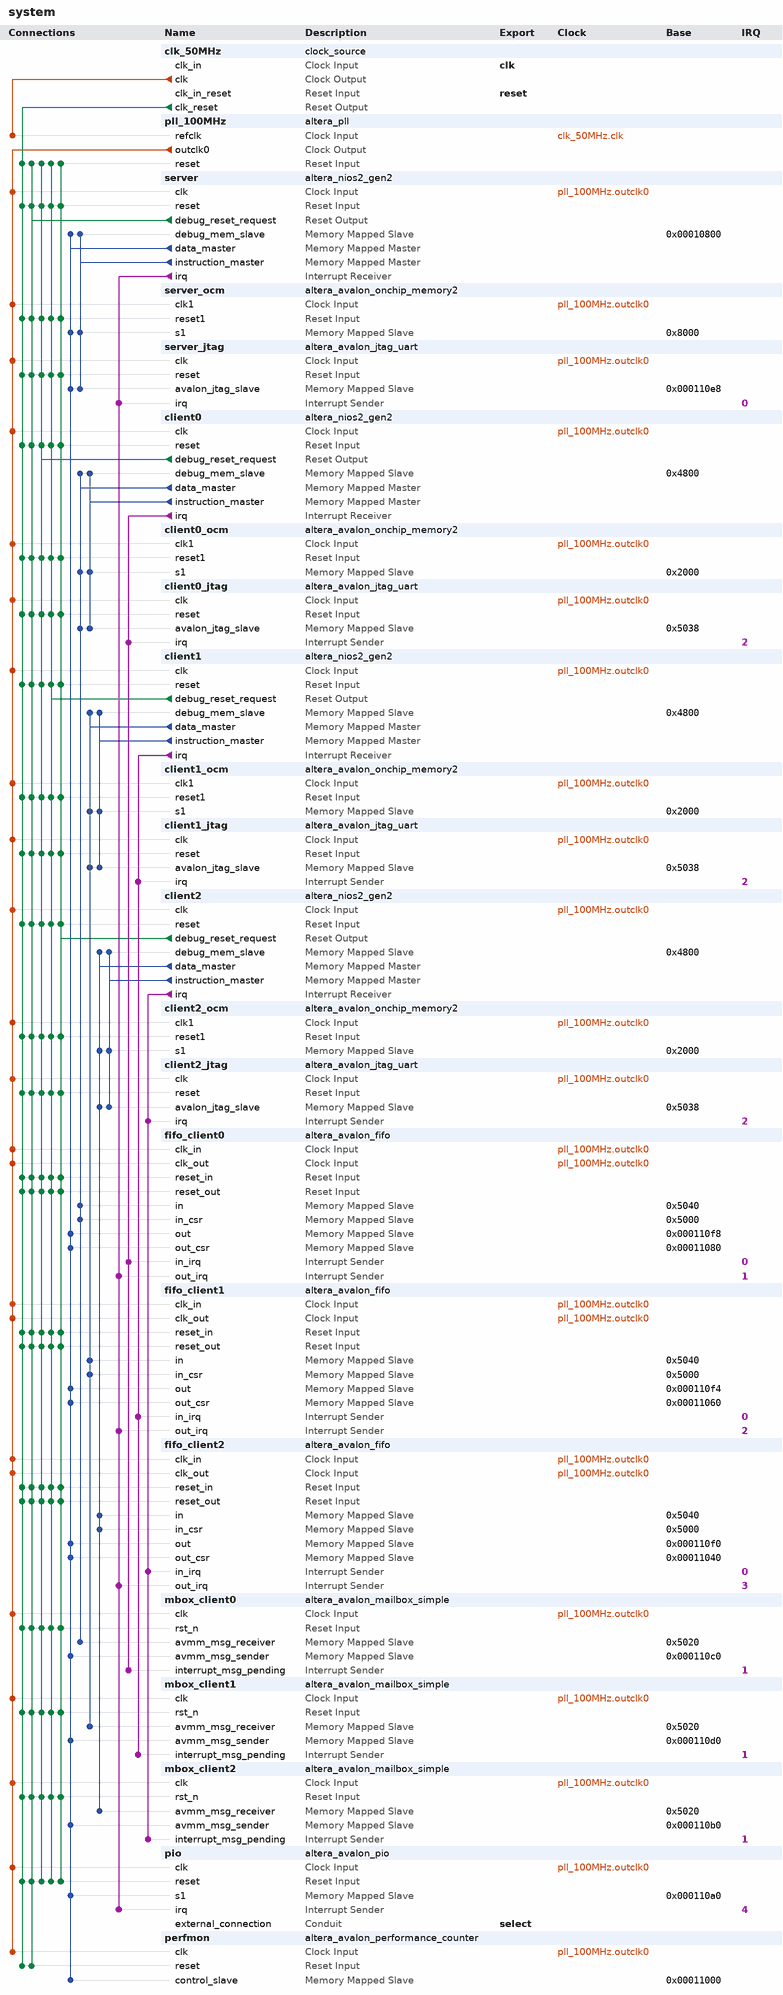
[diagram p0: system contents]
# Platform Designer (Qsys) system system, Cyclone V 5CSEMA5F31C6
# Parameters at their usual value, and those the tool derives, are not listed.
package require -exact qsys 17.0
create_system system
set_project_property DEVICE_FAMILY {Cyclone V}
set_project_property DEVICE 5CSEMA5F31C6

add_instance clk_50MHz clock_source 17.0
set_instance_parameter_value clk_50MHz clockFrequency 50000000

add_instance pll_100MHz altera_pll 17.0
set_instance_parameter_value pll_100MHz gui_device_speed_grade 1
set_instance_parameter_value pll_100MHz gui_number_of_clocks 1
set_instance_parameter_value pll_100MHz gui_operation_mode direct
set_instance_parameter_value pll_100MHz gui_output_clock_frequency0 100.0
set_instance_parameter_value pll_100MHz gui_pll_mode {Integer-N PLL}
set_instance_parameter_value pll_100MHz gui_reference_clock_frequency 50.0
set_instance_parameter_value pll_100MHz gui_use_locked false

add_instance server altera_nios2_gen2 17.0
set_instance_parameter_value server cpuID 1
set_instance_parameter_value server dcache_size 2048
set_instance_parameter_value server exceptionSlave server_ocm.s1
set_instance_parameter_value server icache_size 4096
set_instance_parameter_value server impl Fast
set_instance_parameter_value server resetSlave server_ocm.s1

add_instance server_ocm altera_avalon_onchip_memory2 17.0
set_instance_parameter_value server_ocm dataWidth 32
set_instance_parameter_value server_ocm dualPort false
set_instance_parameter_value server_ocm initMemContent false
set_instance_parameter_value server_ocm initializationFileName onchip_mem.hex
set_instance_parameter_value server_ocm memorySize 32768

add_instance server_jtag altera_avalon_jtag_uart 17.0
set_instance_parameter_value server_jtag simInteractiveOptions NO_INTERACTIVE_WINDOWS

add_instance client0 altera_nios2_gen2 17.0
set_instance_parameter_value client0 cpuID 16
set_instance_parameter_value client0 dcache_size 2048
set_instance_parameter_value client0 exceptionSlave client0_ocm.s1
set_instance_parameter_value client0 icache_size 4096
set_instance_parameter_value client0 impl Fast
set_instance_parameter_value client0 resetSlave client0_ocm.s1

add_instance client0_ocm altera_avalon_onchip_memory2 17.0
set_instance_parameter_value client0_ocm dataWidth 32
set_instance_parameter_value client0_ocm dualPort false
set_instance_parameter_value client0_ocm initMemContent false
set_instance_parameter_value client0_ocm initializationFileName onchip_mem.hex
set_instance_parameter_value client0_ocm memorySize 8192

add_instance client0_jtag altera_avalon_jtag_uart 17.0
set_instance_parameter_value client0_jtag simInteractiveOptions NO_INTERACTIVE_WINDOWS

add_instance client1 altera_nios2_gen2 17.0
set_instance_parameter_value client1 cpuID 17
set_instance_parameter_value client1 dcache_size 2048
set_instance_parameter_value client1 exceptionSlave client1_ocm.s1
set_instance_parameter_value client1 icache_size 4096
set_instance_parameter_value client1 impl Fast
set_instance_parameter_value client1 resetSlave client1_ocm.s1

add_instance client1_ocm altera_avalon_onchip_memory2 17.0
set_instance_parameter_value client1_ocm dataWidth 32
set_instance_parameter_value client1_ocm dualPort false
set_instance_parameter_value client1_ocm initMemContent false
set_instance_parameter_value client1_ocm initializationFileName onchip_mem.hex
set_instance_parameter_value client1_ocm memorySize 8192

add_instance client1_jtag altera_avalon_jtag_uart 17.0
set_instance_parameter_value client1_jtag simInteractiveOptions NO_INTERACTIVE_WINDOWS

add_instance client2 altera_nios2_gen2 17.0
set_instance_parameter_value client2 cpuID 18
set_instance_parameter_value client2 dcache_size 2048
set_instance_parameter_value client2 exceptionSlave client2_ocm.s1
set_instance_parameter_value client2 icache_size 4096
set_instance_parameter_value client2 impl Fast
set_instance_parameter_value client2 resetSlave client2_ocm.s1

add_instance client2_ocm altera_avalon_onchip_memory2 17.0
set_instance_parameter_value client2_ocm dataWidth 32
set_instance_parameter_value client2_ocm dualPort false
set_instance_parameter_value client2_ocm initMemContent false
set_instance_parameter_value client2_ocm initializationFileName onchip_mem.hex
set_instance_parameter_value client2_ocm memorySize 8192

add_instance client2_jtag altera_avalon_jtag_uart 17.0
set_instance_parameter_value client2_jtag simInteractiveOptions NO_INTERACTIVE_WINDOWS

add_instance fifo_client0 altera_avalon_fifo 17.0
set_instance_parameter_value fifo_client0 bitsPerSymbol 16
set_instance_parameter_value fifo_client0 channelWidth 8
set_instance_parameter_value fifo_client0 errorWidth 8
set_instance_parameter_value fifo_client0 fifoDepth 16
set_instance_parameter_value fifo_client0 fifoInputInterfaceOptions AVALONMM_WRITE
set_instance_parameter_value fifo_client0 fifoOutputInterfaceOptions AVALONMM_READ
set_instance_parameter_value fifo_client0 singleClockMode false
set_instance_parameter_value fifo_client0 symbolsPerBeat 2
set_instance_parameter_value fifo_client0 useIRQ true
set_instance_parameter_value fifo_client0 usePacket true
set_instance_parameter_value fifo_client0 useReadControl true

add_instance fifo_client1 altera_avalon_fifo 17.0
set_instance_parameter_value fifo_client1 bitsPerSymbol 16
set_instance_parameter_value fifo_client1 channelWidth 8
set_instance_parameter_value fifo_client1 errorWidth 8
set_instance_parameter_value fifo_client1 fifoDepth 16
set_instance_parameter_value fifo_client1 fifoInputInterfaceOptions AVALONMM_WRITE
set_instance_parameter_value fifo_client1 fifoOutputInterfaceOptions AVALONMM_READ
set_instance_parameter_value fifo_client1 singleClockMode false
set_instance_parameter_value fifo_client1 symbolsPerBeat 2
set_instance_parameter_value fifo_client1 useIRQ true
set_instance_parameter_value fifo_client1 usePacket true
set_instance_parameter_value fifo_client1 useReadControl true

add_instance fifo_client2 altera_avalon_fifo 17.0
set_instance_parameter_value fifo_client2 bitsPerSymbol 16
set_instance_parameter_value fifo_client2 channelWidth 8
set_instance_parameter_value fifo_client2 errorWidth 8
set_instance_parameter_value fifo_client2 fifoDepth 16
set_instance_parameter_value fifo_client2 fifoInputInterfaceOptions AVALONMM_WRITE
set_instance_parameter_value fifo_client2 fifoOutputInterfaceOptions AVALONMM_READ
set_instance_parameter_value fifo_client2 singleClockMode false
set_instance_parameter_value fifo_client2 symbolsPerBeat 2
set_instance_parameter_value fifo_client2 useIRQ true
set_instance_parameter_value fifo_client2 usePacket true
set_instance_parameter_value fifo_client2 useReadControl true

add_instance mbox_client0 altera_avalon_mailbox_simple 17.0
set_instance_parameter_value mbox_client0 AWIDTH 2
set_instance_parameter_value mbox_client0 DWIDTH 32
set_instance_parameter_value mbox_client0 MSG_ARRIVAL_NOTIFY 1
set_instance_parameter_value mbox_client0 MSG_SPACE_NOTIFY 0

add_instance mbox_client1 altera_avalon_mailbox_simple 17.0
set_instance_parameter_value mbox_client1 AWIDTH 2
set_instance_parameter_value mbox_client1 DWIDTH 32
set_instance_parameter_value mbox_client1 MSG_ARRIVAL_NOTIFY 1
set_instance_parameter_value mbox_client1 MSG_SPACE_NOTIFY 0

add_instance mbox_client2 altera_avalon_mailbox_simple 17.0
set_instance_parameter_value mbox_client2 AWIDTH 2
set_instance_parameter_value mbox_client2 DWIDTH 32
set_instance_parameter_value mbox_client2 MSG_ARRIVAL_NOTIFY 1
set_instance_parameter_value mbox_client2 MSG_SPACE_NOTIFY 0

add_instance pio altera_avalon_pio 17.0
set_instance_parameter_value pio bitClearingEdgeCapReg true
set_instance_parameter_value pio captureEdge true
set_instance_parameter_value pio direction Input
set_instance_parameter_value pio edgeType ANY
set_instance_parameter_value pio generateIRQ true
set_instance_parameter_value pio irqType EDGE
set_instance_parameter_value pio width 1

add_instance perfmon altera_avalon_performance_counter 17.0
set_instance_parameter_value perfmon numberOfSections 3

# connections
add_connection clk_50MHz.clk pll_100MHz.refclk clock
add_connection pll_100MHz.outclk0 client0.clk clock
add_connection pll_100MHz.outclk0 client0_jtag.clk clock
add_connection pll_100MHz.outclk0 client0_ocm.clk1 clock
add_connection pll_100MHz.outclk0 client1.clk clock
add_connection pll_100MHz.outclk0 client1_jtag.clk clock
add_connection pll_100MHz.outclk0 client1_ocm.clk1 clock
add_connection pll_100MHz.outclk0 client2.clk clock
add_connection pll_100MHz.outclk0 client2_jtag.clk clock
add_connection pll_100MHz.outclk0 client2_ocm.clk1 clock
add_connection pll_100MHz.outclk0 fifo_client0.clk_in clock
add_connection pll_100MHz.outclk0 fifo_client0.clk_out clock
add_connection pll_100MHz.outclk0 fifo_client1.clk_in clock
add_connection pll_100MHz.outclk0 fifo_client1.clk_out clock
add_connection pll_100MHz.outclk0 fifo_client2.clk_in clock
add_connection pll_100MHz.outclk0 fifo_client2.clk_out clock
add_connection pll_100MHz.outclk0 mbox_client0.clk clock
add_connection pll_100MHz.outclk0 mbox_client1.clk clock
add_connection pll_100MHz.outclk0 mbox_client2.clk clock
add_connection pll_100MHz.outclk0 perfmon.clk clock
add_connection pll_100MHz.outclk0 pio.clk clock
add_connection pll_100MHz.outclk0 server.clk clock
add_connection pll_100MHz.outclk0 server_jtag.clk clock
add_connection pll_100MHz.outclk0 server_ocm.clk1 clock
add_connection client0.debug_reset_request client0.reset reset
add_connection client0.debug_reset_request client0_jtag.reset reset
add_connection client0.debug_reset_request client0_ocm.reset1 reset
add_connection client0.debug_reset_request client1.reset reset
add_connection client0.debug_reset_request client1_jtag.reset reset
add_connection client0.debug_reset_request client1_ocm.reset1 reset
add_connection client0.debug_reset_request client2.reset reset
add_connection client0.debug_reset_request client2_jtag.reset reset
add_connection client0.debug_reset_request client2_ocm.reset1 reset
add_connection client0.debug_reset_request fifo_client0.reset_in reset
add_connection client0.debug_reset_request fifo_client0.reset_out reset
add_connection client0.debug_reset_request fifo_client1.reset_in reset
add_connection client0.debug_reset_request fifo_client1.reset_out reset
add_connection client0.debug_reset_request fifo_client2.reset_in reset
add_connection client0.debug_reset_request fifo_client2.reset_out reset
add_connection client0.debug_reset_request mbox_client0.rst_n reset
add_connection client0.debug_reset_request mbox_client1.rst_n reset
add_connection client0.debug_reset_request mbox_client2.rst_n reset
add_connection client0.debug_reset_request pio.reset reset
add_connection client0.debug_reset_request pll_100MHz.reset reset
add_connection client0.debug_reset_request server.reset reset
add_connection client0.debug_reset_request server_jtag.reset reset
add_connection client0.debug_reset_request server_ocm.reset1 reset
add_connection client1.debug_reset_request client0.reset reset
add_connection client1.debug_reset_request client0_jtag.reset reset
add_connection client1.debug_reset_request client0_ocm.reset1 reset
add_connection client1.debug_reset_request client1.reset reset
add_connection client1.debug_reset_request client1_jtag.reset reset
add_connection client1.debug_reset_request client1_ocm.reset1 reset
add_connection client1.debug_reset_request client2.reset reset
add_connection client1.debug_reset_request client2_jtag.reset reset
add_connection client1.debug_reset_request client2_ocm.reset1 reset
add_connection client1.debug_reset_request fifo_client0.reset_in reset
add_connection client1.debug_reset_request fifo_client0.reset_out reset
add_connection client1.debug_reset_request fifo_client1.reset_in reset
add_connection client1.debug_reset_request fifo_client1.reset_out reset
add_connection client1.debug_reset_request fifo_client2.reset_in reset
add_connection client1.debug_reset_request fifo_client2.reset_out reset
add_connection client1.debug_reset_request mbox_client0.rst_n reset
add_connection client1.debug_reset_request mbox_client1.rst_n reset
add_connection client1.debug_reset_request mbox_client2.rst_n reset
add_connection client1.debug_reset_request pio.reset reset
add_connection client1.debug_reset_request pll_100MHz.reset reset
add_connection client1.debug_reset_request server.reset reset
add_connection client1.debug_reset_request server_jtag.reset reset
add_connection client1.debug_reset_request server_ocm.reset1 reset
add_connection client2.debug_reset_request client0.reset reset
add_connection client2.debug_reset_request client0_jtag.reset reset
add_connection client2.debug_reset_request client0_ocm.reset1 reset
add_connection client2.debug_reset_request client1.reset reset
add_connection client2.debug_reset_request client1_jtag.reset reset
add_connection client2.debug_reset_request client1_ocm.reset1 reset
add_connection client2.debug_reset_request client2.reset reset
add_connection client2.debug_reset_request client2_jtag.reset reset
add_connection client2.debug_reset_request client2_ocm.reset1 reset
add_connection client2.debug_reset_request fifo_client0.reset_in reset
add_connection client2.debug_reset_request fifo_client0.reset_out reset
add_connection client2.debug_reset_request fifo_client1.reset_in reset
add_connection client2.debug_reset_request fifo_client1.reset_out reset
add_connection client2.debug_reset_request fifo_client2.reset_in reset
add_connection client2.debug_reset_request fifo_client2.reset_out reset
add_connection client2.debug_reset_request mbox_client0.rst_n reset
add_connection client2.debug_reset_request mbox_client1.rst_n reset
add_connection client2.debug_reset_request mbox_client2.rst_n reset
add_connection client2.debug_reset_request pio.reset reset
add_connection client2.debug_reset_request pll_100MHz.reset reset
add_connection client2.debug_reset_request server.reset reset
add_connection client2.debug_reset_request server_jtag.reset reset
add_connection client2.debug_reset_request server_ocm.reset1 reset
add_connection clk_50MHz.clk_reset client0.reset reset
add_connection clk_50MHz.clk_reset client0_jtag.reset reset
add_connection clk_50MHz.clk_reset client0_ocm.reset1 reset
add_connection clk_50MHz.clk_reset client1.reset reset
add_connection clk_50MHz.clk_reset client1_jtag.reset reset
add_connection clk_50MHz.clk_reset client1_ocm.reset1 reset
add_connection clk_50MHz.clk_reset client2.reset reset
add_connection clk_50MHz.clk_reset client2_jtag.reset reset
add_connection clk_50MHz.clk_reset client2_ocm.reset1 reset
add_connection clk_50MHz.clk_reset fifo_client0.reset_in reset
add_connection clk_50MHz.clk_reset fifo_client0.reset_out reset
add_connection clk_50MHz.clk_reset fifo_client1.reset_in reset
add_connection clk_50MHz.clk_reset fifo_client1.reset_out reset
add_connection clk_50MHz.clk_reset fifo_client2.reset_in reset
add_connection clk_50MHz.clk_reset fifo_client2.reset_out reset
add_connection clk_50MHz.clk_reset mbox_client0.rst_n reset
add_connection clk_50MHz.clk_reset mbox_client1.rst_n reset
add_connection clk_50MHz.clk_reset mbox_client2.rst_n reset
add_connection clk_50MHz.clk_reset perfmon.reset reset
add_connection clk_50MHz.clk_reset pio.reset reset
add_connection clk_50MHz.clk_reset pll_100MHz.reset reset
add_connection clk_50MHz.clk_reset server.reset reset
add_connection clk_50MHz.clk_reset server_jtag.reset reset
add_connection clk_50MHz.clk_reset server_ocm.reset1 reset
add_connection server.debug_reset_request client0.reset reset
add_connection server.debug_reset_request client0_jtag.reset reset
add_connection server.debug_reset_request client0_ocm.reset1 reset
add_connection server.debug_reset_request client1.reset reset
add_connection server.debug_reset_request client1_jtag.reset reset
add_connection server.debug_reset_request client1_ocm.reset1 reset
add_connection server.debug_reset_request client2.reset reset
add_connection server.debug_reset_request client2_jtag.reset reset
add_connection server.debug_reset_request client2_ocm.reset1 reset
add_connection server.debug_reset_request fifo_client0.reset_in reset
add_connection server.debug_reset_request fifo_client0.reset_out reset
add_connection server.debug_reset_request fifo_client1.reset_in reset
add_connection server.debug_reset_request fifo_client1.reset_out reset
add_connection server.debug_reset_request fifo_client2.reset_in reset
add_connection server.debug_reset_request fifo_client2.reset_out reset
add_connection server.debug_reset_request mbox_client0.rst_n reset
add_connection server.debug_reset_request mbox_client1.rst_n reset
add_connection server.debug_reset_request mbox_client2.rst_n reset
add_connection server.debug_reset_request perfmon.reset reset
add_connection server.debug_reset_request pio.reset reset
add_connection server.debug_reset_request pll_100MHz.reset reset
add_connection server.debug_reset_request server.reset reset
add_connection server.debug_reset_request server_jtag.reset reset
add_connection server.debug_reset_request server_ocm.reset1 reset
add_connection client0.data_master client0.debug_mem_slave avalon
set_connection_parameter_value client0.data_master/client0.debug_mem_slave baseAddress 0x4800
add_connection client0.data_master client0_jtag.avalon_jtag_slave avalon
set_connection_parameter_value client0.data_master/client0_jtag.avalon_jtag_slave baseAddress 0x5038
add_connection client0.data_master client0_ocm.s1 avalon
set_connection_parameter_value client0.data_master/client0_ocm.s1 baseAddress 0x2000
add_connection client0.data_master fifo_client0.in avalon
set_connection_parameter_value client0.data_master/fifo_client0.in baseAddress 0x5040
add_connection client0.data_master fifo_client0.in_csr avalon
set_connection_parameter_value client0.data_master/fifo_client0.in_csr baseAddress 0x5000
add_connection client0.data_master mbox_client0.avmm_msg_receiver avalon
set_connection_parameter_value client0.data_master/mbox_client0.avmm_msg_receiver baseAddress 0x5020
add_connection client0.instruction_master client0.debug_mem_slave avalon
set_connection_parameter_value client0.instruction_master/client0.debug_mem_slave baseAddress 0x4800
add_connection client0.instruction_master client0_jtag.avalon_jtag_slave avalon
set_connection_parameter_value client0.instruction_master/client0_jtag.avalon_jtag_slave baseAddress 0x5038
add_connection client0.instruction_master client0_ocm.s1 avalon
set_connection_parameter_value client0.instruction_master/client0_ocm.s1 baseAddress 0x2000
add_connection client1.data_master client1.debug_mem_slave avalon
set_connection_parameter_value client1.data_master/client1.debug_mem_slave baseAddress 0x4800
add_connection client1.data_master client1_jtag.avalon_jtag_slave avalon
set_connection_parameter_value client1.data_master/client1_jtag.avalon_jtag_slave baseAddress 0x5038
add_connection client1.data_master client1_ocm.s1 avalon
set_connection_parameter_value client1.data_master/client1_ocm.s1 baseAddress 0x2000
add_connection client1.data_master fifo_client1.in avalon
set_connection_parameter_value client1.data_master/fifo_client1.in baseAddress 0x5040
add_connection client1.data_master fifo_client1.in_csr avalon
set_connection_parameter_value client1.data_master/fifo_client1.in_csr baseAddress 0x5000
add_connection client1.data_master mbox_client1.avmm_msg_receiver avalon
set_connection_parameter_value client1.data_master/mbox_client1.avmm_msg_receiver baseAddress 0x5020
add_connection client1.instruction_master client1.debug_mem_slave avalon
set_connection_parameter_value client1.instruction_master/client1.debug_mem_slave baseAddress 0x4800
add_connection client1.instruction_master client1_jtag.avalon_jtag_slave avalon
set_connection_parameter_value client1.instruction_master/client1_jtag.avalon_jtag_slave baseAddress 0x5038
add_connection client1.instruction_master client1_ocm.s1 avalon
set_connection_parameter_value client1.instruction_master/client1_ocm.s1 baseAddress 0x2000
add_connection client2.data_master client2.debug_mem_slave avalon
set_connection_parameter_value client2.data_master/client2.debug_mem_slave baseAddress 0x4800
add_connection client2.data_master client2_jtag.avalon_jtag_slave avalon
set_connection_parameter_value client2.data_master/client2_jtag.avalon_jtag_slave baseAddress 0x5038
add_connection client2.data_master client2_ocm.s1 avalon
set_connection_parameter_value client2.data_master/client2_ocm.s1 baseAddress 0x2000
add_connection client2.data_master fifo_client2.in avalon
set_connection_parameter_value client2.data_master/fifo_client2.in baseAddress 0x5040
add_connection client2.data_master fifo_client2.in_csr avalon
set_connection_parameter_value client2.data_master/fifo_client2.in_csr baseAddress 0x5000
add_connection client2.data_master mbox_client2.avmm_msg_receiver avalon
set_connection_parameter_value client2.data_master/mbox_client2.avmm_msg_receiver baseAddress 0x5020
add_connection client2.instruction_master client2.debug_mem_slave avalon
set_connection_parameter_value client2.instruction_master/client2.debug_mem_slave baseAddress 0x4800
add_connection client2.instruction_master client2_jtag.avalon_jtag_slave avalon
set_connection_parameter_value client2.instruction_master/client2_jtag.avalon_jtag_slave baseAddress 0x5038
add_connection client2.instruction_master client2_ocm.s1 avalon
set_connection_parameter_value client2.instruction_master/client2_ocm.s1 baseAddress 0x2000
add_connection server.data_master fifo_client0.out avalon
set_connection_parameter_value server.data_master/fifo_client0.out baseAddress 0x000110f8
add_connection server.data_master fifo_client0.out_csr avalon
set_connection_parameter_value server.data_master/fifo_client0.out_csr baseAddress 0x00011080
add_connection server.data_master fifo_client1.out avalon
set_connection_parameter_value server.data_master/fifo_client1.out baseAddress 0x000110f4
add_connection server.data_master fifo_client1.out_csr avalon
set_connection_parameter_value server.data_master/fifo_client1.out_csr baseAddress 0x00011060
add_connection server.data_master fifo_client2.out avalon
set_connection_parameter_value server.data_master/fifo_client2.out baseAddress 0x000110f0
add_connection server.data_master fifo_client2.out_csr avalon
set_connection_parameter_value server.data_master/fifo_client2.out_csr baseAddress 0x00011040
add_connection server.data_master mbox_client0.avmm_msg_sender avalon
set_connection_parameter_value server.data_master/mbox_client0.avmm_msg_sender baseAddress 0x000110c0
add_connection server.data_master mbox_client1.avmm_msg_sender avalon
set_connection_parameter_value server.data_master/mbox_client1.avmm_msg_sender baseAddress 0x000110d0
add_connection server.data_master mbox_client2.avmm_msg_sender avalon
set_connection_parameter_value server.data_master/mbox_client2.avmm_msg_sender baseAddress 0x000110b0
add_connection server.data_master perfmon.control_slave avalon
set_connection_parameter_value server.data_master/perfmon.control_slave baseAddress 0x00011000
add_connection server.data_master pio.s1 avalon
set_connection_parameter_value server.data_master/pio.s1 baseAddress 0x000110a0
add_connection server.data_master server.debug_mem_slave avalon
set_connection_parameter_value server.data_master/server.debug_mem_slave baseAddress 0x00010800
add_connection server.data_master server_jtag.avalon_jtag_slave avalon
set_connection_parameter_value server.data_master/server_jtag.avalon_jtag_slave baseAddress 0x000110e8
add_connection server.data_master server_ocm.s1 avalon
set_connection_parameter_value server.data_master/server_ocm.s1 baseAddress 0x8000
add_connection server.instruction_master server.debug_mem_slave avalon
set_connection_parameter_value server.instruction_master/server.debug_mem_slave baseAddress 0x00010800
add_connection server.instruction_master server_jtag.avalon_jtag_slave avalon
set_connection_parameter_value server.instruction_master/server_jtag.avalon_jtag_slave baseAddress 0x000110e8
add_connection server.instruction_master server_ocm.s1 avalon
set_connection_parameter_value server.instruction_master/server_ocm.s1 baseAddress 0x8000
add_connection client0.irq client0_jtag.irq interrupt
set_connection_parameter_value client0.irq/client0_jtag.irq irqNumber 2
add_connection client0.irq fifo_client0.in_irq interrupt
set_connection_parameter_value client0.irq/fifo_client0.in_irq irqNumber 0
add_connection client0.irq mbox_client0.interrupt_msg_pending interrupt
set_connection_parameter_value client0.irq/mbox_client0.interrupt_msg_pending irqNumber 1
add_connection client1.irq client1_jtag.irq interrupt
set_connection_parameter_value client1.irq/client1_jtag.irq irqNumber 2
add_connection client1.irq fifo_client1.in_irq interrupt
set_connection_parameter_value client1.irq/fifo_client1.in_irq irqNumber 0
add_connection client1.irq mbox_client1.interrupt_msg_pending interrupt
set_connection_parameter_value client1.irq/mbox_client1.interrupt_msg_pending irqNumber 1
add_connection client2.irq client2_jtag.irq interrupt
set_connection_parameter_value client2.irq/client2_jtag.irq irqNumber 2
add_connection client2.irq fifo_client2.in_irq interrupt
set_connection_parameter_value client2.irq/fifo_client2.in_irq irqNumber 0
add_connection client2.irq mbox_client2.interrupt_msg_pending interrupt
set_connection_parameter_value client2.irq/mbox_client2.interrupt_msg_pending irqNumber 1
add_connection server.irq fifo_client0.out_irq interrupt
set_connection_parameter_value server.irq/fifo_client0.out_irq irqNumber 1
add_connection server.irq fifo_client1.out_irq interrupt
set_connection_parameter_value server.irq/fifo_client1.out_irq irqNumber 2
add_connection server.irq fifo_client2.out_irq interrupt
set_connection_parameter_value server.irq/fifo_client2.out_irq irqNumber 3
add_connection server.irq pio.irq interrupt
set_connection_parameter_value server.irq/pio.irq irqNumber 4
add_connection server.irq server_jtag.irq interrupt
set_connection_parameter_value server.irq/server_jtag.irq irqNumber 0

# exported interfaces
add_interface clk clock sink
set_interface_property clk EXPORT_OF clk_50MHz.clk_in
add_interface reset reset sink
set_interface_property reset EXPORT_OF clk_50MHz.clk_in_reset
add_interface select conduit end
set_interface_property select EXPORT_OF pio.external_connection

set_interconnect_requirement {$system} qsys_mm.clockCrossingAdapter HANDSHAKE
set_interconnect_requirement {$system} qsys_mm.enableEccProtection FALSE
set_interconnect_requirement {$system} qsys_mm.insertDefaultSlave FALSE
set_interconnect_requirement {$system} qsys_mm.maxAdditionalLatency 1

save_system system.qsys
